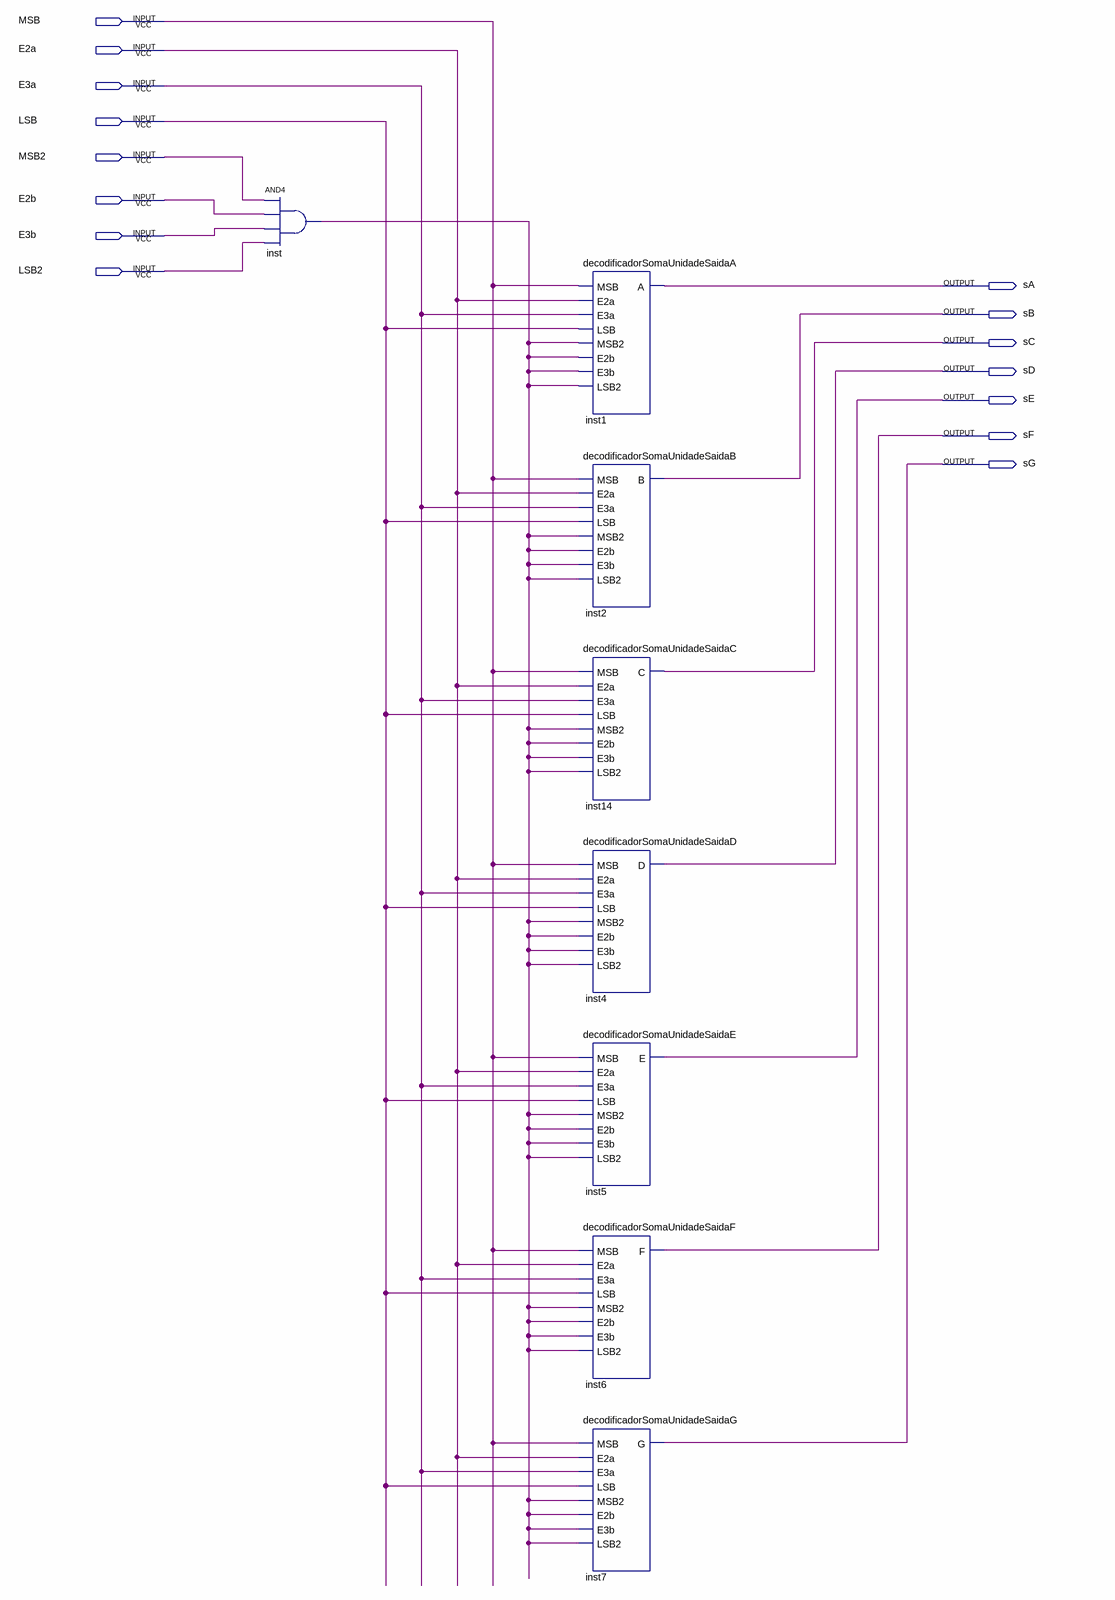
[diagram p0: schematic sheet]
// Quartus schematic decodificadorSomaUnidade.bdf as structural Verilog: 8 symbols, 15 pins
module decodificadorSomaUnidade (
  input  MSB,
  input  E2a,
  input  E3a,
  input  LSB,
  input  MSB2,
  input  E2b,
  input  E3b,
  input  LSB2,
  output sA,
  output sB,
  output sC,
  output sD,
  output sE,
  output sF,
  output sG
);

  wire inst_out;

  and inst (inst_out, MSB2, E2b, E3b, LSB2);
  decodificadorSomaUnidadeSaidaA inst1 (
    .MSB(MSB), .E2a(E2a), .E3a(E3a), .LSB(LSB), .MSB2(inst_out), .E2b(inst_out), .E3b(inst_out),
    .LSB2(inst_out), .A(sA));
  decodificadorSomaUnidadeSaidaB inst2 (
    .MSB(MSB), .E2a(E2a), .E3a(E3a), .LSB(LSB), .MSB2(inst_out), .E2b(inst_out), .E3b(inst_out),
    .LSB2(inst_out), .B(sB));
  decodificadorSomaUnidadeSaidaC inst14 (
    .MSB(MSB), .E2a(E2a), .E3a(E3a), .LSB(LSB), .MSB2(inst_out), .E2b(inst_out), .E3b(inst_out),
    .LSB2(inst_out), .C(sC));
  decodificadorSomaUnidadeSaidaD inst4 (
    .MSB(MSB), .E2a(E2a), .E3a(E3a), .LSB(LSB), .MSB2(inst_out), .E2b(inst_out), .E3b(inst_out),
    .LSB2(inst_out), .D(sD));
  decodificadorSomaUnidadeSaidaE inst5 (
    .MSB(MSB), .E2a(E2a), .E3a(E3a), .LSB(LSB), .MSB2(inst_out), .E2b(inst_out), .E3b(inst_out),
    .LSB2(inst_out), .E(sE));
  decodificadorSomaUnidadeSaidaF inst6 (
    .MSB(MSB), .E2a(E2a), .E3a(E3a), .LSB(LSB), .MSB2(inst_out), .E2b(inst_out), .E3b(inst_out),
    .LSB2(inst_out), .F(sF));
  decodificadorSomaUnidadeSaidaG inst7 (
    .MSB(MSB), .E2a(E2a), .E3a(E3a), .LSB(LSB), .MSB2(inst_out), .E2b(inst_out), .E3b(inst_out),
    .LSB2(inst_out), .G(sG));
endmodule
